# EAGLE design teensyMotors02_up_LED_SX (EAGLE 9.1.3)

## Sheet 1 of 2
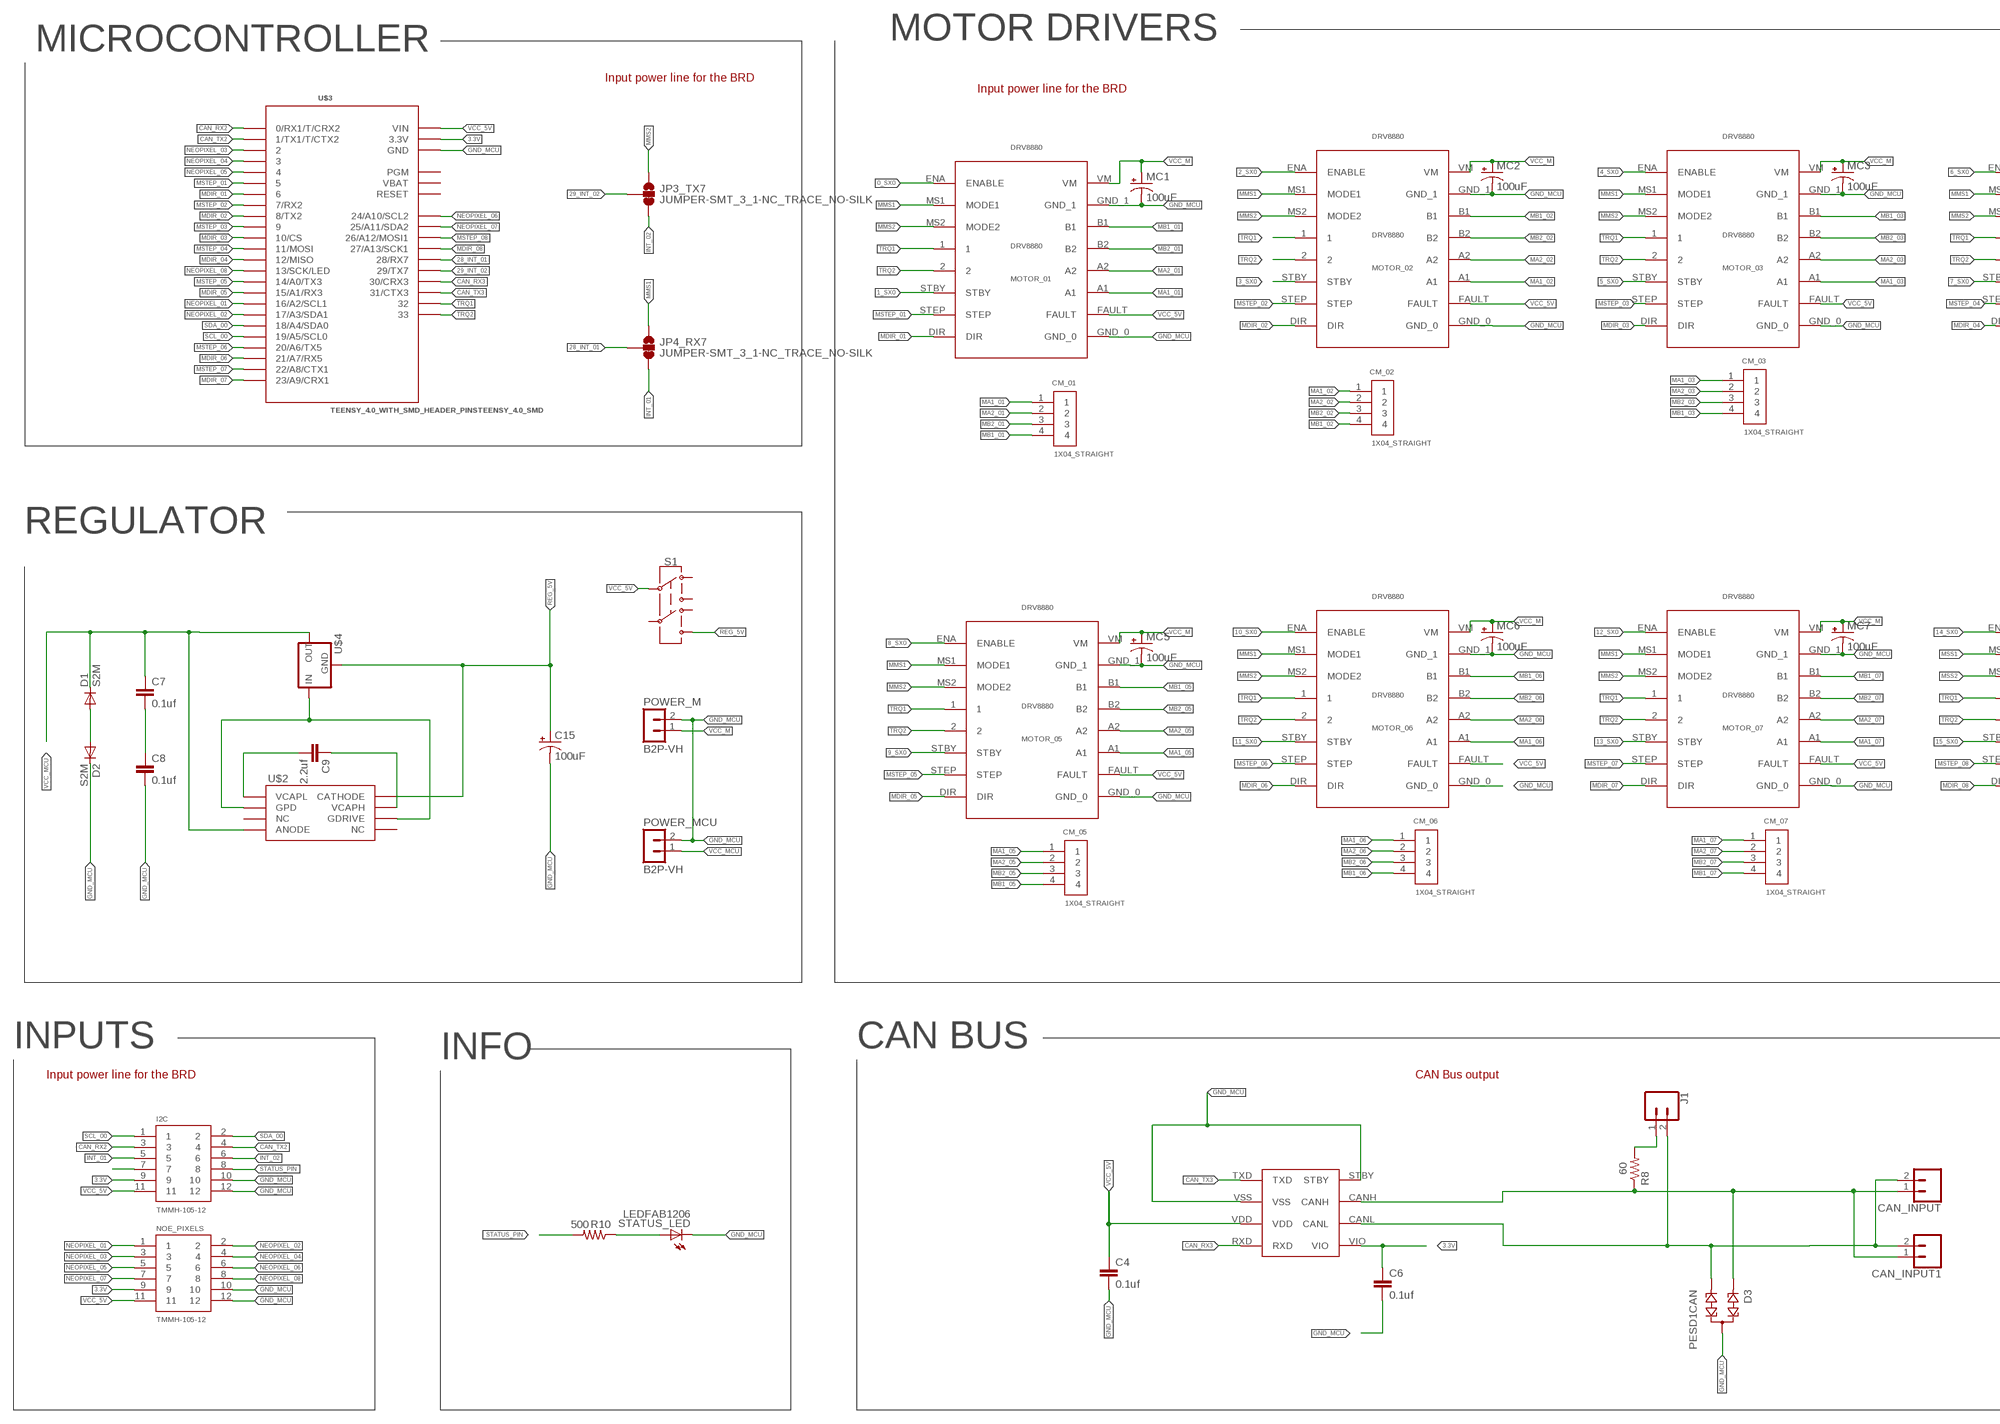
[diagram p0: schematic, sheet 1, part 1 of 2]
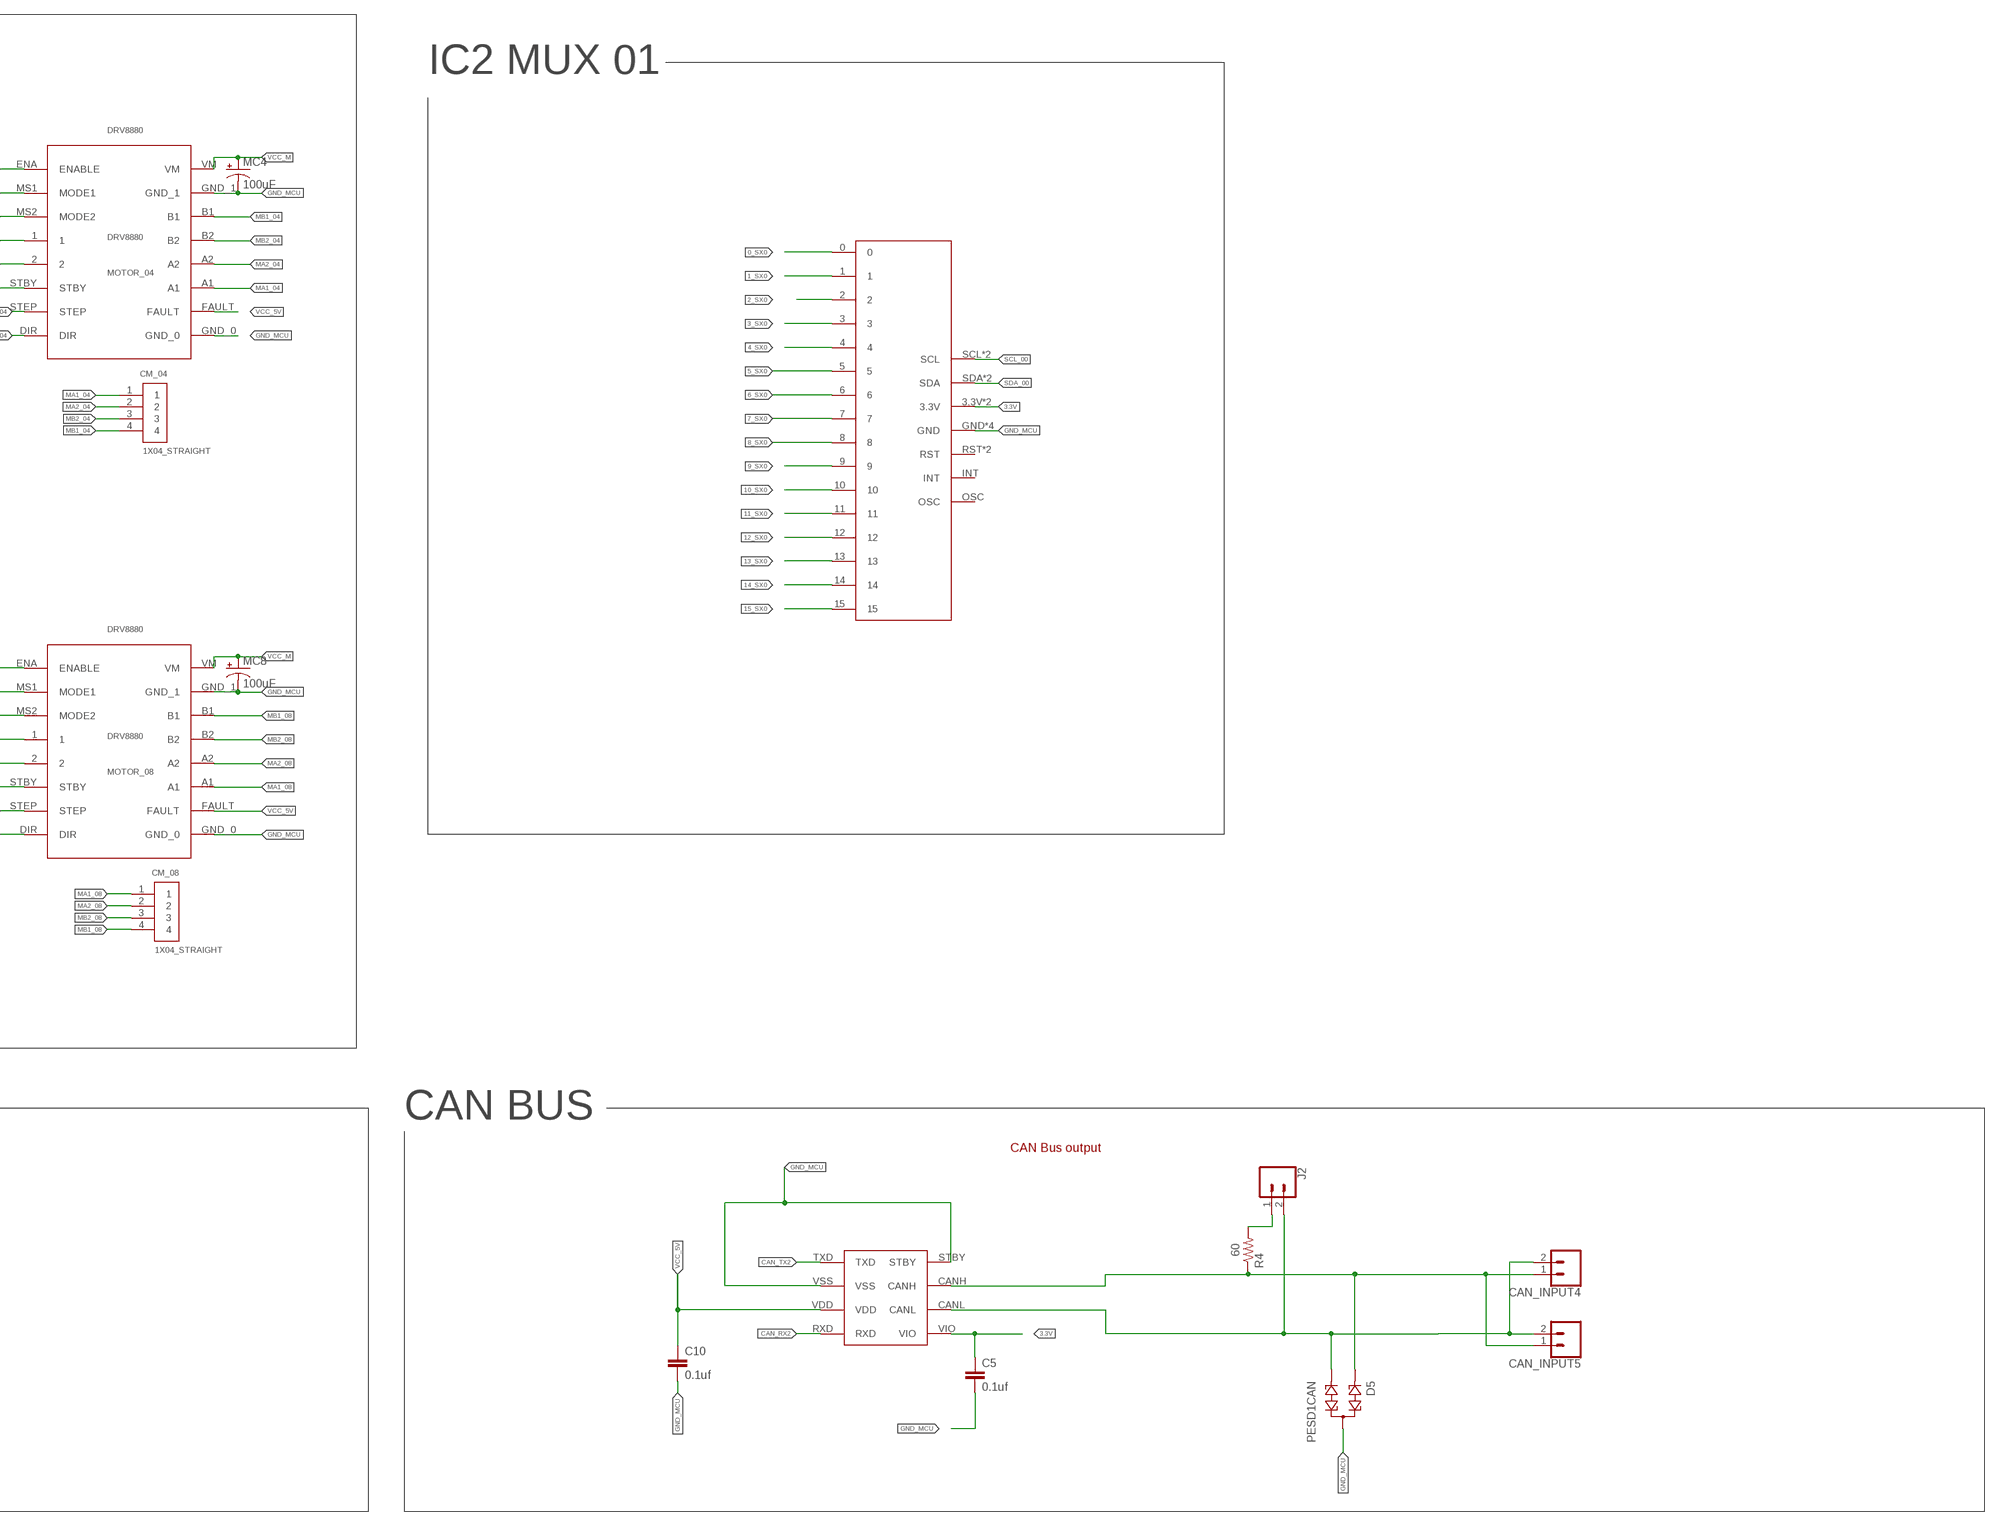
[diagram p1: schematic, sheet 1, part 2 of 2]

### Parts
C4  0.1uf  0.1UF-25V(+80/-20%)(0603)  [0603-CAP]
C5  0.1uf  0.1UF-25V(+80/-20%)(0603)  [0603-CAP]
C6  0.1uf  0.1UF-25V(+80/-20%)(0603)  [0603-CAP]
C7  0.1uf  0.1UF-25V(+80/-20%)(0603)  [0603-CAP]
C8  0.1uf  0.1UF-25V(+80/-20%)(0603)  [0603-CAP]
C9  2.2uf  0.1UF-25V(+80/-20%)(0603)  [0603-CAP]
C10  0.1uf  0.1UF-25V(+80/-20%)(0603)  [0603-CAP]
C15  100uF  100UF-POLAR-25V-20%(ELEC)  [PANASONIC_D]
CAN_INPUT  CONN_02-JST-2MM-SMT  [JST-2-SMD]
CAN_INPUT1  CONN_02-JST-2MM-SMT  [JST-2-SMD]
CAN_INPUT4  CONN_02-JST-2MM-SMT  [JST-2-SMD]
CAN_INPUT5  CONN_02-JST-2MM-SMT  [JST-2-SMD]
CM_01  1X04_STRAIGHT  1X4-CLEANBIG  [1X04-CLEANBIG]
CM_02  1X04_STRAIGHT  1X4-CLEANBIG  [1X04-CLEANBIG]
CM_03  1X04_STRAIGHT  1X4-CLEANBIG  [1X04-CLEANBIG]
CM_04  1X04_STRAIGHT  1X4-CLEANBIG  [1X04-CLEANBIG]
CM_05  1X04_STRAIGHT  1X4-CLEANBIG  [1X04-CLEANBIG]
CM_06  1X04_STRAIGHT  1X4-CLEANBIG  [1X04-CLEANBIG]
CM_07  1X04_STRAIGHT  1X4-CLEANBIG  [1X04-CLEANBIG]
CM_08  1X04_STRAIGHT  1X4-CLEANBIG  [1X04-CLEANBIG]
D1  S2M  [DO214AA]
D2  S2M  [DO214AA]
D3  PESD1CAN  [SOT23]
D5  PESD1CAN  [SOT23]
I2C  TMMH-105-12  [TMMH-105-12]
J1  CONN_02  [1X02]
J2  CONN_02  [1X02]
JP3_TX7  JUMPER-SMT_3_1-NC_TRACE_NO-SILK  [SMT-JUMPER_3_1-NC_TRACE_NO-SILK]
JP4_RX7  JUMPER-SMT_3_1-NC_TRACE_NO-SILK  [SMT-JUMPER_3_1-NC_TRACE_NO-SILK]
MC1  100uF  100UF-POLAR-25V-20%(ELEC)  [PANASONIC_D]
MC2  100uF  100UF-POLAR-25V-20%(ELEC)  [PANASONIC_D]
MC3  100uF  100UF-POLAR-25V-20%(ELEC)  [PANASONIC_D]
MC4  100uF  100UF-POLAR-25V-20%(ELEC)  [PANASONIC_D]
MC5  100uF  100UF-POLAR-25V-20%(ELEC)  [PANASONIC_D]
MC6  100uF  100UF-POLAR-25V-20%(ELEC)  [PANASONIC_D]
MC7  100uF  100UF-POLAR-25V-20%(ELEC)  [PANASONIC_D]
MC8  100uF  100UF-POLAR-25V-20%(ELEC)  [PANASONIC_D]
MOTOR_01  DRV8880  [DRV8880]
MOTOR_02  DRV8880  [DRV8880]
MOTOR_03  DRV8880  [DRV8880]
MOTOR_04  DRV8880  [DRV8880]
MOTOR_05  DRV8880  [DRV8880]
MOTOR_06  DRV8880  [DRV8880]
MOTOR_07  DRV8880  [DRV8880]
MOTOR_08  DRV8880  [DRV8880]
NOE_PIXELS  TMMH-105-12  [TMMH-105-12]
POWER_M  B2P-VH  [B2P-VH]
POWER_MCU  B2P-VH  [B2P-VH]
R4  60  10KOHM-1/10W-1%(0603)0603  [0603-RES]
R8  60  10KOHM-1/10W-1%(0603)0603  [0603-RES]
R10  500  10KOHM-1/10W-1%(0603)0603  [0603-RES]
S1  SWITCH-DPDT-SMD-AYZ0202  [SWITCH_DPDT_SMD_AYZ0202]
STATUS_LED  LEDFAB1206  [LED1206FAB]
U$1  MCP2562  [MCP2562]
U$2  LM74610-Q1  [VSSOP(8)]
U$3  TEENSY_4.0_WITH_SMD_HEADER_PINSTEENSY_4.0_SMD  [TEENSY_4.0_SMD]
U$4  BUK  [TO263-3]
U$5  SX1509  [SX1509]
U$6  MCP2562  [MCP2562]

### Nets
0_SX0: MOTOR_01.ENA(ENABLE) U$5.0
1_SX0: MOTOR_01.STBY U$5.1
2_SX0: MOTOR_02.ENA(ENABLE) U$5.2
3.3V [vcc]: C5.1 C6.1 I2C.9 NOE_PIXELS.9 U$1.VIO U$3.3.3V U$3.3.3V1(3.3V) U$5.3.3V U$5.3.3V_1(3.3V) U$6.VIO
3_SX0: MOTOR_02.STBY U$5.3
4_SX0: MOTOR_03.ENA(ENABLE) U$5.4
5_SX0: MOTOR_03.STBY U$5.5
6_SX0: MOTOR_04.ENA(ENABLE) U$5.6
7_SX0: MOTOR_04.STBY U$5.7
8_SX0: MOTOR_05.ENA(ENABLE) U$5.8
9_SX0: MOTOR_05.STBY U$5.9
10_SX0: MOTOR_06.ENA(ENABLE) U$5.10
11_SX0: MOTOR_06.STBY U$5.11
12_SX0: MOTOR_07.ENA(ENABLE) U$5.12
13_SX0: MOTOR_07.STBY U$5.13
14_SX0: MOTOR_08.ENA(ENABLE) U$5.14
15_SX0: MOTOR_08.STBY U$5.15
28_INT_01: JP4_RX7.2 U$3.28(28/RX7)
29_INT_02: JP3_TX7.2 U$3.29(29/TX7)
CAN_H: CAN_INPUT1.1 CAN_INPUT.1 D3.1 R8.1 U$1.CANH
CAN_H2: CAN_INPUT4.1 CAN_INPUT5.1 D5.1 R4.1 U$6.CANH
CAN_L: CAN_INPUT1.2 CAN_INPUT.2 D3.2 J1.2 U$1.CANL
CAN_L2: CAN_INPUT4.2 CAN_INPUT5.2 D5.2 J2.2 U$6.CANL
CAN_RX2: I2C.3 U$3.0(0/RX1/T/CRX2) U$6.RXD
CAN_RX3: U$1.RXD U$3.30(30/CRX3)
CAN_TX2: I2C.4 U$3.1(1/TX1/T/CTX2) U$6.TXD
CAN_TX3: U$1.TXD U$3.31(31/CTX3)
GND_MCU [gnd]: C4.2 C5.2 C6.2 C8.2 C10.2 C15.- D2.C D3.3 D5.3 I2C.10 I2C.12 MC1.- MC2.- MC3.- MC4.- MC5.- MC6.- MC7.- MC8.- MOTOR_01.GND_0 MOTOR_01.GND_1 MOTOR_02.GND_0 MOTOR_02.GND_1 MOTOR_03.GND_0 MOTOR_03.GND_1 MOTOR_04.GND_0 MOTOR_04.GND_1 MOTOR_05.GND_0 MOTOR_05.GND_1 MOTOR_06.GND_0 MOTOR_06.GND_1 MOTOR_07.GND_0 MOTOR_07.GND_1 MOTOR_08.GND_0 MOTOR_08.GND_1 NOE_PIXELS.10 NOE_PIXELS.12 POWER_M.2 POWER_MCU.2 STATUS_LED.2(C) U$1.STBY U$1.VSS U$3.GND U$3.GND1(GND) U$3.GND2(GND) U$5.GND U$5.GND_1(GND) U$5.GND_2(GND) U$5.GND_3(GND) U$6.STBY U$6.VSS
INT_01: I2C.5 JP4_RX7.3
INT_02: I2C.6 JP3_TX7.3
MA1_01 [vcc]: CM_01.1 MOTOR_01.A1
MA1_02 [vcc]: CM_02.1 MOTOR_02.A1
MA1_03 [vcc]: CM_03.1 MOTOR_03.A1
MA1_04 [vcc]: CM_04.1 MOTOR_04.A1
MA1_05 [vcc]: CM_05.1 MOTOR_05.A1
MA1_06 [vcc]: CM_06.1 MOTOR_06.A1
MA1_07 [vcc]: CM_07.1 MOTOR_07.A1
MA1_08 [vcc]: CM_08.1 MOTOR_08.A1
MA2_01 [vcc]: CM_01.2 MOTOR_01.A2
MA2_02 [vcc]: CM_02.2 MOTOR_02.A2
MA2_03 [vcc]: CM_03.2 MOTOR_03.A2
MA2_04 [vcc]: CM_04.2 MOTOR_04.A2
MA2_05 [vcc]: CM_05.2 MOTOR_05.A2
MA2_06 [vcc]: CM_06.2 MOTOR_06.A2
MA2_07 [vcc]: CM_07.2 MOTOR_07.A2
MA2_08 [vcc]: CM_08.2 MOTOR_08.A2
MB1_01 [vcc]: CM_01.4 MOTOR_01.B1
MB1_02 [vcc]: CM_02.4 MOTOR_02.B1
MB1_03 [vcc]: CM_03.4 MOTOR_03.B1
MB1_04 [vcc]: CM_04.4 MOTOR_04.B1
MB1_05 [vcc]: CM_05.4 MOTOR_05.B1
MB1_06 [vcc]: CM_06.4 MOTOR_06.B1
MB1_07 [vcc]: CM_07.4 MOTOR_07.B1
MB1_08 [vcc]: CM_08.4 MOTOR_08.B1
MB2_01 [vcc]: CM_01.3 MOTOR_01.B2
MB2_02 [vcc]: CM_02.3 MOTOR_02.B2
MB2_03 [vcc]: CM_03.3 MOTOR_03.B2
MB2_04 [vcc]: CM_04.3 MOTOR_04.B2
MB2_05 [vcc]: CM_05.3 MOTOR_05.B2
MB2_06 [vcc]: CM_06.3 MOTOR_06.B2
MB2_07 [vcc]: CM_07.3 MOTOR_07.B2
MB2_08 [vcc]: CM_08.3 MOTOR_08.B2
MDIR_01: MOTOR_01.DIR U$3.6
MDIR_02: MOTOR_02.DIR U$3.8(8/TX2)
MDIR_03: MOTOR_03.DIR U$3.10(10/CS)
MDIR_04: MOTOR_04.DIR U$3.12(12/MISO)
MDIR_05: MOTOR_05.DIR U$3.15/A1(15/A1/RX3)
MDIR_06: MOTOR_06.DIR U$3.21/A7(21/A7/RX5)
MDIR_07: MOTOR_07.DIR U$3.23/A9(23/A9/CRX1)
MDIR_08: MOTOR_08.DIR U$3.27(27/A13/SCK1)
MMS1: JP4_RX7.1 MOTOR_01.MS1(MODE1) MOTOR_02.MS1(MODE1) MOTOR_03.MS1(MODE1) MOTOR_04.MS1(MODE1) MOTOR_05.MS1(MODE1) MOTOR_06.MS1(MODE1) MOTOR_07.MS1(MODE1)
MMS2: JP3_TX7.1 MOTOR_01.MS2(MODE2) MOTOR_02.MS2(MODE2) MOTOR_03.MS2(MODE2) MOTOR_04.MS2(MODE2) MOTOR_05.MS2(MODE2) MOTOR_06.MS2(MODE2) MOTOR_07.MS2(MODE2)
MSS1: MOTOR_08.MS1(MODE1)
MSS2: MOTOR_08.MS2(MODE2)
MSTEP_01: MOTOR_01.STEP U$3.5
MSTEP_02: MOTOR_02.STEP U$3.7(7/RX2)
MSTEP_03: MOTOR_03.STEP U$3.9
MSTEP_04: MOTOR_04.STEP U$3.11(11/MOSI)
MSTEP_05: MOTOR_05.STEP U$3.14/A0(14/A0/TX3)
MSTEP_06: MOTOR_06.STEP U$3.20/A6(20/A6/TX5)
MSTEP_07: MOTOR_07.STEP U$3.22/A8(22/A8/CTX1)
MSTEP_08: MOTOR_08.STEP U$3.26(26/A12/MOSI1)
N$1: J1.1 R8.2
N$2: C9.1 U$2.VCAPH
N$3: J2.1 R4.2
N$4: U$2.GDRIVE U$2.GPD U$4.1(IN)
N$5: C9.2 U$2.VCAPL
N$9: C7.2 C8.1
N$12: D1.A D2.A
N$193: R10.1 STATUS_LED.1(A)
NEOPIXEL_01: NOE_PIXELS.1 U$3.16/A2(16/A2/SCL1)
NEOPIXEL_02: NOE_PIXELS.2 U$3.17/A3(17/A3/SDA1)
NEOPIXEL_03: NOE_PIXELS.3 U$3.2
NEOPIXEL_04: NOE_PIXELS.4 U$3.3
NEOPIXEL_05: NOE_PIXELS.5 U$3.4
NEOPIXEL_06: NOE_PIXELS.6 U$3.24(24/A10/SCL2)
NEOPIXEL_07: NOE_PIXELS.7 U$3.25(25/A11/SDA2)
NEOPIXEL_08: NOE_PIXELS.8 U$3.13(13/SCK/LED)
PIN_EX: I2C.7
REG_5V [vcc5]: C15.+ S1.6 U$2.CATHODE U$4.4(GND)
SCL_00: I2C.1 U$3.19/A5(19/A5/SCL0) U$5.SCL U$5.SCL_2(SCL)
SDA_00: I2C.2 U$3.18/A4(18/A4/SDA0) U$5.SDA U$5.SDA_2(SDA)
STATUS_PIN: I2C.8 R10.2
TRQ1: MOTOR_01.1 MOTOR_02.1 MOTOR_03.1 MOTOR_04.1 MOTOR_05.1 MOTOR_06.1 MOTOR_07.1 MOTOR_08.1 U$3.32
TRQ2: MOTOR_01.2 MOTOR_02.2 MOTOR_03.2 MOTOR_04.2 MOTOR_05.2 MOTOR_06.2 MOTOR_07.2 MOTOR_08.2 U$3.33
VCC_5V [vcc5]: C4.1 C10.1 I2C.11 MOTOR_01.FAULT MOTOR_02.FAULT MOTOR_03.FAULT MOTOR_04.FAULT MOTOR_05.FAULT MOTOR_06.FAULT MOTOR_07.FAULT MOTOR_08.FAULT NOE_PIXELS.11 S1.2 U$1.VDD U$3.VIN U$6.VDD
VCC_M [vcc]: MC1.+ MC2.+ MC3.+ MC4.+ MC5.+ MC6.+ MC7.+ MC8.+ MOTOR_01.VM MOTOR_02.VM MOTOR_03.VM MOTOR_04.VM MOTOR_05.VM MOTOR_06.VM MOTOR_07.VM MOTOR_08.VM POWER_M.1
VCC_MCU [vcc]: C7.1 D1.C POWER_MCU.1 U$2.ANODE U$4.3(OUT)
Unconnected: S1.1 S1.3 S1.4 S1.5 U$2.NC@1(NC) U$2.NC@2(NC) U$3.PGM U$3.RESET U$5.INT U$5.OSC U$5.RST U$5.RST_1(RST)

### Notes on the sheet
- MICROCONTROLLER | MOTOR DRIVERS
- Input power line for the BRD
- Input power line for the BRD | IC2 MUX 01
- REGULATOR
- INPUTS | INFO | CAN BUS | CAN BUS
- Input power line for the BRD | CAN Bus output | CAN Bus output

## Sheet 2 of 2

## Power pins joined to a net without a drawn wire
VBAT: U$3.VBAT

## Library data of the parts
C4-C10 = SparkFun-Capacitors:0.1UF-25V(+80/-20%)(0603): CAP-00810 Ceramic Standard decoupling cap; PROD_ID: CAP-00810; VALUE: 0.1uF
C15 MC1-MC8 = SparkFun-Capacitors:100UF-POLAR: 100µF polarized capacitors A capacitor is a passive two-terminal electrical component used to store electrical energy temporarily in an electric field.; PROD_ID: CAP-12547
CAN_INPUT CAN_INPUT1 CAN_INPUT4 CAN_INPUT5 = SparkFun-Connectors:CONN_02: Multi connection point. Often used as Generic Header-pin footprint for 0.1 inch spaced/style header connections On any of the 0.1 inch spaced packages, you can populate with these: Break Away Headers - Straight <https://www.sparkfun.com/products/116> (PRT-00116) Break Away Male Headers - Right Angle <https://www.sparkfun.com/products/553> (PRT-00553) Female Headers <https://www.sparkfun.com/products/115> (PRT-00115) Break Away Headers - Machine Pin <https://www.sparkfun.com/products/117> (PRT-00117) Break Away Female Headers - Swiss Machine Pin <https://www.sparkfun.com/products/743> (PRT-00743) For SCREWTERMINALS and SPRING TERMINALS visit here: Screw Terimnals on SparkFun.com <https://www.sparkfun.com/search/results?term=Screw+Terminals> (5mm/3.5mm/2.54mm spacing) This device is also useful as a general connection point to wire up your design to another part of your project. Our various solder wires solder well into these plated through hole pads. Hook-Up Wire - Assortment (Stranded, 22 AWG) <https://www.sparkfun.com/products/11375> (PRT-11375) Hook-Up Wire - Assortment (Solid Core, 22 AWG) <https://www.sparkfun.com/products/11367> (PRT-11367) View the entire wire category on our website here <https://www.sparkfun.com/categories/141> Special notes: Molex polarized connector foot print use with: PRT-08233 with associated crimp pins and housings. 2.54_SCREWTERM for use with PRT-10571. 3.5mm Screw Terminal footprints for PRT-08084 5mm Screw Terminal footprints for use with PRT-08432; PROD_ID: CONN-11443
CM_01-CM_08 = adafruit:1X4: 4-pin connector
D1 D2 = s2x_10:S2*: S2A - S2M General Purpose Rectifiers Source: http://www.fairchildsemi.com/datasheets/S2/S2A.pdf; MF: Fairchild; MPN: S2M; OC_FARNELL: 9843876; OC_NEWARK: 58K9553
D3 D5 = diode:PESD1CAN: CAN bus ESD protection diode Source: http://www.nxp.com/documents/data_sheet/PESD1CAN.pdf
I2C NOE_PIXELS = TMMH-105-XX-XX-DV:TMMH-105-12: 2mm (.0787") Flex Shroud, .020" (.51mm) Square Post Terminal Strip, Surface Mount,10 Pins.
J1 J2 = SparkFun-Connectors:CONN_02: Multi connection point. Often used as Generic Header-pin footprint for 0.1 inch spaced/style header connections On any of the 0.1 inch spaced packages, you can populate with these: Break Away Headers - Straight <https://www.sparkfun.com/products/116> (PRT-00116) Break Away Male Headers - Right Angle <https://www.sparkfun.com/products/553> (PRT-00553) Female Headers <https://www.sparkfun.com/products/115> (PRT-00115) Break Away Headers - Machine Pin <https://www.sparkfun.com/products/117> (PRT-00117) Break Away Female Headers - Swiss Machine Pin <https://www.sparkfun.com/products/743> (PRT-00743) For SCREWTERMINALS and SPRING TERMINALS visit here: Screw Terimnals on SparkFun.com <https://www.sparkfun.com/search/results?term=Screw+Terminals> (5mm/3.5mm/2.54mm spacing) This device is also useful as a general connection point to wire up your design to another part of your project. Our various solder wires solder well into these plated through hole pads. Hook-Up Wire - Assortment (Stranded, 22 AWG) <https://www.sparkfun.com/products/11375> (PRT-11375) Hook-Up Wire - Assortment (Solid Core, 22 AWG) <https://www.sparkfun.com/products/11367> (PRT-11367) View the entire wire category on our website here <https://www.sparkfun.com/categories/141> Special notes: Molex polarized connector foot print use with: PRT-08233 with associated crimp pins and housings. 2.54_SCREWTERM for use with PRT-10571. 3.5mm Screw Terminal footprints for PRT-08084 5mm Screw Terminal footprints for use with PRT-08432
JP3_TX7 JP4_RX7 = SparkFun-Jumpers:JUMPER-SMT_3_1-NC_TRACE: Normally closed trace jumper (1 of 2 connections) This jumper has a trace between two pads so it's normally closed (NC). The other connection is normally open (NO). Use a razor knife to open the connection. For best results follow the IPC guidelines for cutting traces: Cutout at least 0.063 mm (0.005 in). Remove all loose material to clean up the cut area. Seal the cut with an approved epoxy. Reapply solder to reclose the connection, or to close the NO connection.
MOTOR_01-MOTOR_08 = STSPIN220:DRV8880
POWER_M POWER_MCU = con-JST VH:B2P-VH: JST VH Series header 3.96mm pitch disconnectable crimp style connectors, vertical (side entry type), 2 pins
R4 R8 R10 = SparkFun-Resistors:10KOHM-1/10W-1%(0603): RES-00824; PROD_ID: RES-00824; VALUE: 10K
S1 = SparkFun-Switches:SWITCH-DPDT: Double-Pole, Double-Throw (DPDT) Switch Double-pole, double-throw switches. Variant Overview PTH-GPI-152-3013 Used on SparkFun Geiger Counter <https://www.sparkfun.com/products/11345> SMD-AY0202 Surface Mount DPDT Switch <https://www.sparkfun.com/products/597> (COM-00597) Used on e.g. LilyPad Arduino USB - ATmega32U4 Board <https://www.sparkfun.com/products/12049>; PROD_ID: SWCH-08179; SF_SKU: COM-00597; SPICEPREFIX: X
STATUS_LED = fab:LED: LED
U$1 U$6 = MCP2562:MCP2562
U$2 = 1zac:LM74610-Q1: LM74610-Q1 Zero IQ Reverse Polarity Protection Smart Diode Controller; MPN: LM74610-Q1
U$3 = Teensy4:TEENSY_4.0_WITH_SMD_HEADER_PINS: Footprint for Teensy 3.1 or 3.2 board using all pin connections on the outer perimeter
U$4 = v-reg-2:BUK
U$5 = SX1509_s:SX1509

## Net classes
0 default: width 0.2 mm, clearance 0.2 mm
1 gnd: width 0.2 mm, clearance 0.2 mm
3 vcc: width 0.2 mm, clearance 0.2 mm
4 vcc5: width 0.35 mm, clearance 0.2 mm

## Board
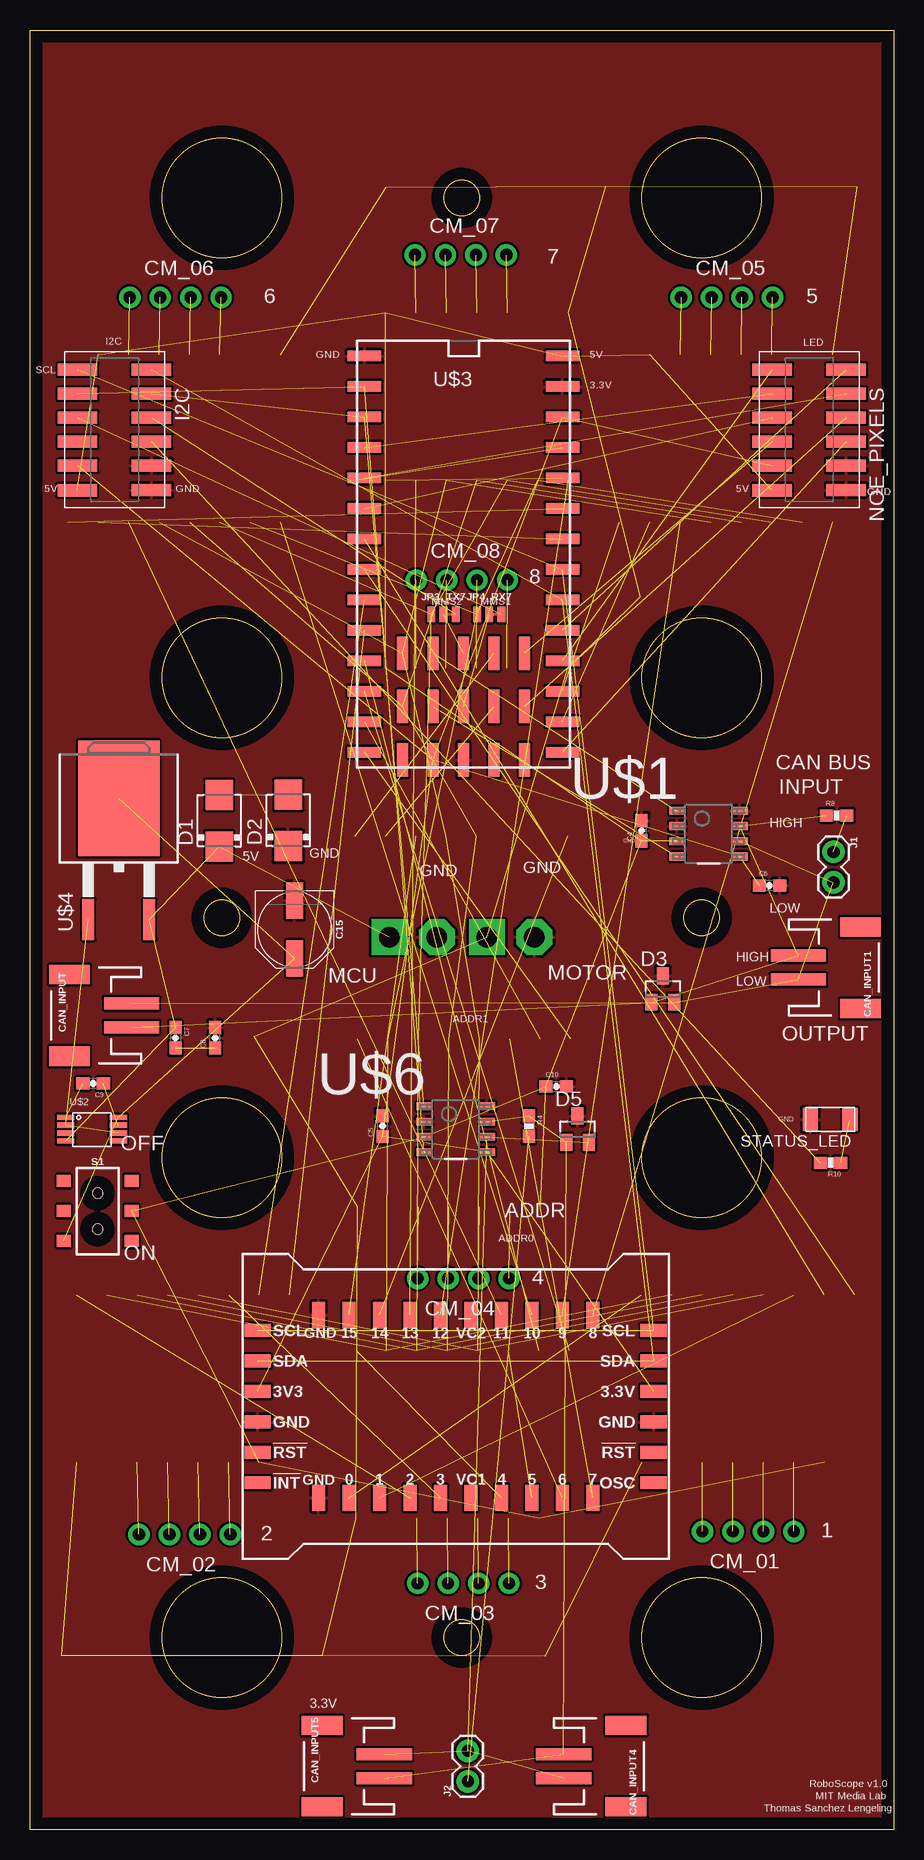
[diagram p2: board, top side]
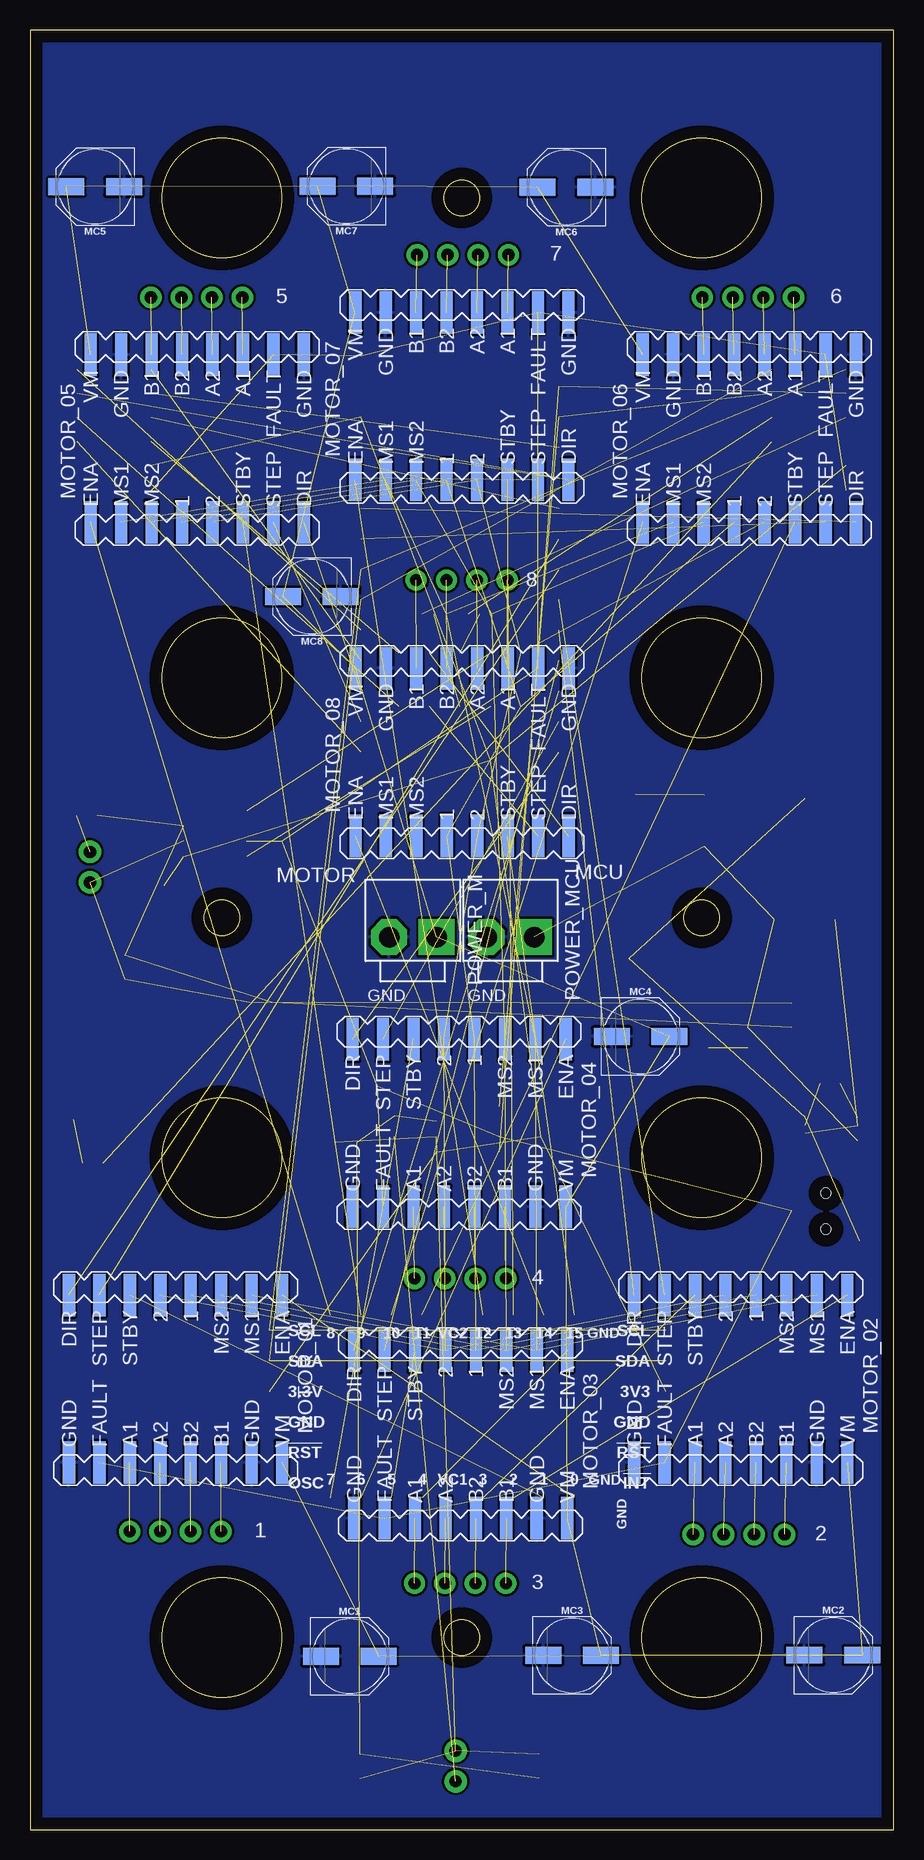
[diagram p3: board, bottom side, seen from below]

Size 72 x 150 mm. Coordinates in mm from the lower left corner, seen from the top.
Outline: 72,150 72,0 0,0 0,150 72,150
Outline: circle at 56,136 radius 5
Outline: circle at 56,96 radius 5
Outline: circle at 56,56 radius 5
Outline: circle at 56,16 radius 5
Outline: circle at 16,16 radius 5
Outline: circle at 16,56 radius 5
Outline: circle at 16,96 radius 5
Outline: circle at 16,136 radius 5
Outline: circle at 36,136 radius 1.5
Outline: circle at 16,76 radius 1.5
Outline: circle at 36,16 radius 1.5
Outline: circle at 56,76 radius 1.5
Copper layers (1*16): Top 0.035mm / dielectric 1.5mm / Bottom 0.035mm
Design rules "default *": minimum track width 6mil, minimum drill 0.35mm, track to track 6mil, track to pad 6mil, pad to pad 6mil, via to via 6mil, smd to smd 6mil, copper to edge 40mil, drill to drill 6mil, minimum pad ring 10mil, minimum via ring 8mil, stop-mask expansion 4mil, vias tented up to drill 0mil, thermal gap 10mil

### Footprints (pad centres in the part's own frame; a part is rotated, then mirrored left to right if it is on the bottom)
0603-CAP = smd 1.1 x 1: 1 -0.85,0; 2 0.85,0
PANASONIC_D = smd 3 x 1.4: + 2.4,0; - -2.4,0
JST-2-SMD = smd 1 x 4.6: 1 -1,-3.7; 2 1,-3.7 | smd 1.6 x 3.4: NC1 -3.4,1.5; NC2 3.4,1.5
1X04-CLEANBIG = drill 1.016 pad 1.778: 1 -3.81,0; 2 -1.27,0; 3 1.27,0; 4 3.81,0
DO214AA = smd 2.5 x 2.3: A 2.15,0; C -2.15,0
SOT23 = smd 1 x 1.4: 1 -0.95,-1.1; 2 0.95,-1.1; 3 0,1.1
TMMH-105-12 = smd 1.016 x 3.302: 1 -5.27,-3.086; 2 -5.27,3.086; 3 -3.27,-3.086; 4 -3.27,3.086; 5 -1.27,-3.086; 6 -1.27,3.086; 7 0.73,-3.086; 8 0.73,3.086; 9 2.73,-3.086; 10 2.73,3.086; 11 4.781,-3.099; 12 4.755,3.086
1X02 = drill 1.016 pad 1.88: 1 0,0; 2 2.54,0
SMT-JUMPER_3_1-NC_TRACE_NO-SILK = smd 0.635 x 1.27: 1 -1.016,0; 2 0,0; 3 1.016,0
DRV8880 = smd 3.556 x 1.016: 1 -6.985,1.27; 2 -6.985,-1.27; A1 6.985,-3.81; A2 6.985,-1.27; B1 6.985,3.81; B2 6.985,1.27; DIR -6.985,-8.89; ENA -6.985,8.89; FAULT 6.985,-6.35; GND_0 6.985,-8.89; GND_1 6.985,6.35; MS1 -6.985,6.35; MS2 -6.985,3.81; STBY -6.985,-3.81; STEP -6.985,-6.35; VM 6.985,8.89
B2P-VH = drill 1.7 pad 3 square: 1 -1.98,0 | drill 1.7 pad 3 octagon: 2 1.98,0
0603-RES = smd 1.1 x 1: 1 -0.85,0; 2 0.85,0
SWITCH_DPDT_SMD_AYZ0202 = smd 1 x 1.15: 1 -2.5,2.825; 2 0,2.825; 3 2.5,2.825; 4 -2.5,-2.825; 5 0,-2.825; 6 2.5,-2.825 | hole 0.85: 1.5,0; -1.5,0
LED1206FAB = smd 1.27 x 1.905: 1 -1.651,0; 2 1.651,0
MCP2562 = smd 1.27 x 0.635: CANH 2.625,0.635; CANL 2.625,-0.635; RXD -2.625,-1.905; STBY 2.625,1.905; TXD -2.625,1.905; VDD -2.625,-0.635; VIO 2.625,-1.905; VSS -2.625,0.635
VSSOP(8) = smd 1.435 x 0.445: ANODE -2.2,-1.05; CATHODE 2.2,0.9; GDRIVE 2.2,-0.4; GPD -2.2,0.25; NC@1 -2.2,-0.4; NC@2 2.2,-1.05; VCAPH 2.2,0.25; VCAPL -2.2,0.9
TEENSY_4.0_SMD = smd 2.794 x 0.889: 0 -8.255,13.97; 1 -8.255,11.43; 2 -8.255,8.89; 3 -8.255,6.35; 3.3V 8.255,11.43; 4 -8.255,3.81; 5 -8.255,1.27; 6 -8.255,-1.27; 7 -8.255,-3.81; 8 -8.255,-6.35; 9 -8.255,-8.89; 10 -8.255,-11.43; 11 -8.255,-13.97; 12 -8.255,-16.51; 13 8.255,-16.51; 14/A0 8.255,-13.97; 15/A1 8.255,-11.43; 16/A2 8.255,-8.89; 17/A3 8.255,-6.35; 18/A4 8.255,-3.81; 19/A5 8.255,-1.27; 20/A6 8.255,1.27; 21/A7 8.255,3.81; 22/A8 8.255,6.35; 23/A9 8.255,8.89; GND -8.255,16.51; GND2 8.255,13.97; VIN 8.255,16.51 | smd 0.889 x 2.794: 3.3V1 -2.54,-17.145; 24 5.08,-12.7; 25 5.08,-8.255; 26 2.54,-12.7; 27 2.54,-8.255; 28 0,-12.7; 29 0,-8.255; 30 -2.54,-12.7; 31 -2.54,-8.255; 32 -5.08,-12.7; 33 -5.08,-8.255; GND1 0,-17.145; PGM 2.54,-17.145; RESET 5.08,-17.145; VBAT -5.08,-17.145
TO263-3 = smd 1 x 3.4: 1 -2.54,-9.14; 3 2.54,-9.14 | smd 6.8 x 9.6: 4 0,0.96
SX1509 = smd 2.184 x 1.067: 0 -7.62,7.62; 1 -7.62,5.08; 2 -7.62,2.54; 3 -7.62,0; 4 -7.62,-5.08; 5 -7.62,-7.62; 6 -7.62,-10.16; 7 -7.62,-12.7; 8 7.62,-12.7; 9 7.62,-10.16; 10 7.62,-7.62; 11 7.62,-5.08; 12 7.62,0; 13 7.62,2.54; 14 7.62,5.08; 15 7.62,7.62; GND_1 7.62,10.16; GND_2 -7.62,10.16; VC2 7.62,-2.54; VCC1 -7.62,-2.54 | smd 1.067 x 2.184: 3.3V 1.27,-17.78; 3.3V_1 1.27,15.24; GND -1.27,-17.78; GND_3 -1.27,15.24; INT -6.35,15.24; OSC -6.35,-17.78; RST -3.81,-17.78; RST_1 -3.81,15.24; SCL 6.35,-17.78; SCL_2 6.35,15.24; SDA 3.81,-17.78; SDA_2 3.81,15.24

### Placement (x,y rotation side)
C4  50.99,83.27 90 top
C5  29.4,58.63 90 top
C6  61.66,78.69 0 top
C7  12.13,65.99 270 top
C8  15.43,65.99 90 top
C9  5.27,62.18 180 top
C10  43.88,61.93 0 top
C15  22.07,75.02 270 top
CAN_INPUT  4.79,67.86 90 top
CAN_INPUT1  67.76,71.84 270 top
CAN_INPUT4  48.2,5.29 270 top
CAN_INPUT5  25.85,5.29 90 top
CM_01  59.88,24.85 180 top
CM_02  12.89,24.59 180 top
CM_03  36.13,20.53 180 top
CM_04  36.13,45.93 180 top
CM_05  58.1,127.72 0 top
CM_06  12.13,127.72 0 top
CM_07  35.91,131.24 0 top
CM_08  36.01,104.15 0 top
D1  15.78,84.09 90 top
D2  21.54,84.11 90 top
D3  52.77,70.06 0 top
D5  45.66,58.37 0 top
I2C  7.05,116.41 270 top
J1  66.99,81.49 270 top
J2  36.51,4.02 90 top
JP3_TX7  34.48,101.3 0 top
JP4_RX7  38.29,101.3 0 top
MC1  45.34,14.45 0 bottom
MC2  5.02,14.54 0 bottom
MC3  26.8,14.51 0 bottom
MC4  21.1,66.1 0 bottom
MC5  66.56,136.94 180 bottom
MC6  27.27,136.89 180 bottom
MC7  45.61,136.98 180 bottom
MC8  48.48,102.77 180 bottom
MOTOR_01  59.86,37.57 270 bottom
MOTOR_02  12.74,37.57 270 bottom
MOTOR_03  36.09,32.94 270 bottom
MOTOR_04  36.22,58.89 270 bottom
MOTOR_05  58.05,115.95 90 bottom
MOTOR_06  12.02,115.95 90 bottom
MOTOR_07  35.99,119.47 90 bottom
MOTOR_08  35.98,89.82 90 bottom
NOE_PIXELS  64.96,116.41 270 top
POWER_M  40.07,74.38 180 bottom
POWER_MCU  31.94,74.38 180 bottom
R4  41.59,58.63 270 top
R8  67.25,84.54 0 top
R10  66.74,55.58 180 top
S1  5.64,51.55 270 top
STATUS_LED  66.72,59.19 180 top
U$1  56.58,83.01 0 top
U$2  5.17,58.45 0 top
U$3  36.15,106.31 0 top
U$4  7.4,85 0 top
U$5  34.23,35.26 90 top
U$6  35.5,58.37 0 top

### Tracks (layer width: path | path; a pad name or v marks a point on that pad's centre or on a via)
0_SX0  (1 unrouted)
1_SX0  (1 unrouted)
2_SX0  (1 unrouted)
3.3V  (9 unrouted)
3_SX0  (1 unrouted)
4_SX0  (1 unrouted)
5_SX0  (1 unrouted)
6_SX0  (1 unrouted)
7_SX0  (1 unrouted)
8_SX0  (1 unrouted)
9_SX0  (1 unrouted)
10_SX0  (1 unrouted)
11_SX0  (1 unrouted)
12_SX0  (1 unrouted)
13_SX0  (1 unrouted)
14_SX0  (1 unrouted)
15_SX0  (1 unrouted)
28_INT_01  (1 unrouted)
29_INT_02  (1 unrouted)
CAN_H  (4 unrouted)
CAN_H2  (4 unrouted)
CAN_L  (4 unrouted)
CAN_L2  (4 unrouted)
CAN_RX2  (2 unrouted)
CAN_RX3  (1 unrouted)
CAN_TX2  (2 unrouted)
CAN_TX3  (1 unrouted)
GND_MCU
  pour Top: -3.11,154.13 75.63,154.13 75.63,-7.16 -3.11,-7.16
  pour Bottom: -4.13,154.13 78.42,154.13 78.42,-6.9 -4.13,-6.9
INT_01  (1 unrouted)
INT_02  (1 unrouted)
MA1_01  (1 unrouted)
MA1_02  (1 unrouted)
MA1_03  (1 unrouted)
MA1_04  (1 unrouted)
MA1_05  (1 unrouted)
MA1_06  (1 unrouted)
MA1_07  (1 unrouted)
MA1_08  (1 unrouted)
MA2_01  (1 unrouted)
MA2_02  (1 unrouted)
MA2_03  (1 unrouted)
MA2_04  (1 unrouted)
MA2_05  (1 unrouted)
MA2_06  (1 unrouted)
MA2_07  (1 unrouted)
MA2_08  (1 unrouted)
MB1_01  (1 unrouted)
MB1_02  (1 unrouted)
MB1_03  (1 unrouted)
MB1_04  (1 unrouted)
MB1_05  (1 unrouted)
MB1_06  (1 unrouted)
MB1_07  (1 unrouted)
MB1_08  (1 unrouted)
MB2_01  (1 unrouted)
MB2_02  (1 unrouted)
MB2_03  (1 unrouted)
MB2_04  (1 unrouted)
MB2_05  (1 unrouted)
MB2_06  (1 unrouted)
MB2_07  (1 unrouted)
MB2_08  (1 unrouted)
MDIR_01  (1 unrouted)
MDIR_02  (1 unrouted)
MDIR_03  (1 unrouted)
MDIR_04  (1 unrouted)
MDIR_05  (1 unrouted)
MDIR_06  (1 unrouted)
MDIR_07  (1 unrouted)
MDIR_08  (1 unrouted)
MMS1  (7 unrouted)
MMS2  (7 unrouted)
MSTEP_01  (1 unrouted)
MSTEP_02  (1 unrouted)
MSTEP_03  (1 unrouted)
MSTEP_04  (1 unrouted)
MSTEP_05  (1 unrouted)
MSTEP_06  (1 unrouted)
MSTEP_07  (1 unrouted)
MSTEP_08  (1 unrouted)
N$1  (1 unrouted)
N$2  (1 unrouted)
N$3  (1 unrouted)
N$4  (2 unrouted)
N$5  (1 unrouted)
N$9  (1 unrouted)
N$12  (1 unrouted)
N$193  (1 unrouted)
NEOPIXEL_01  (1 unrouted)
NEOPIXEL_02  (1 unrouted)
NEOPIXEL_03  (1 unrouted)
NEOPIXEL_04  (1 unrouted)
NEOPIXEL_05  (1 unrouted)
NEOPIXEL_06  (1 unrouted)
NEOPIXEL_07  (1 unrouted)
NEOPIXEL_08  (1 unrouted)
REG_5V  (3 unrouted)
SCL_00  (3 unrouted)
SDA_00  (3 unrouted)
STATUS_PIN  (1 unrouted)
TRQ1  (8 unrouted)
TRQ2  (8 unrouted)
VCC_5V  (15 unrouted)
VCC_M  (16 unrouted)
VCC_MCU  (4 unrouted)

### Text on the board
tPlace: 7 | 6 | 5 | I2C | LED | GND | 5V | SCL | 3.3V | 5V | GND | 5V | GND | 8 | MMS2 | MMS1 | CAN BUS | INPUT | HIGH | GND | 5V | GND | GND | GND | LOW | HIGH | MCU | MOTOR | LOW | ADDR1 | OUTPUT | GND | OFF | ADDR | ADDR0 | ON | 4 | 2 | 1 | 3 | 3.3V | RoboScope v1.0 | MIT Media Lab | Thomas Sanchez Lengeling
bPlace: 7 | 6 | 5 | 8 | MCU | MOTOR | GND | GND | 4 | 2 | 1 | 3